# Altium schematic sheet HB_Drive.SchDoc
size 420 x 297 mm; SheetNumber: 2; SheetTotal: 5
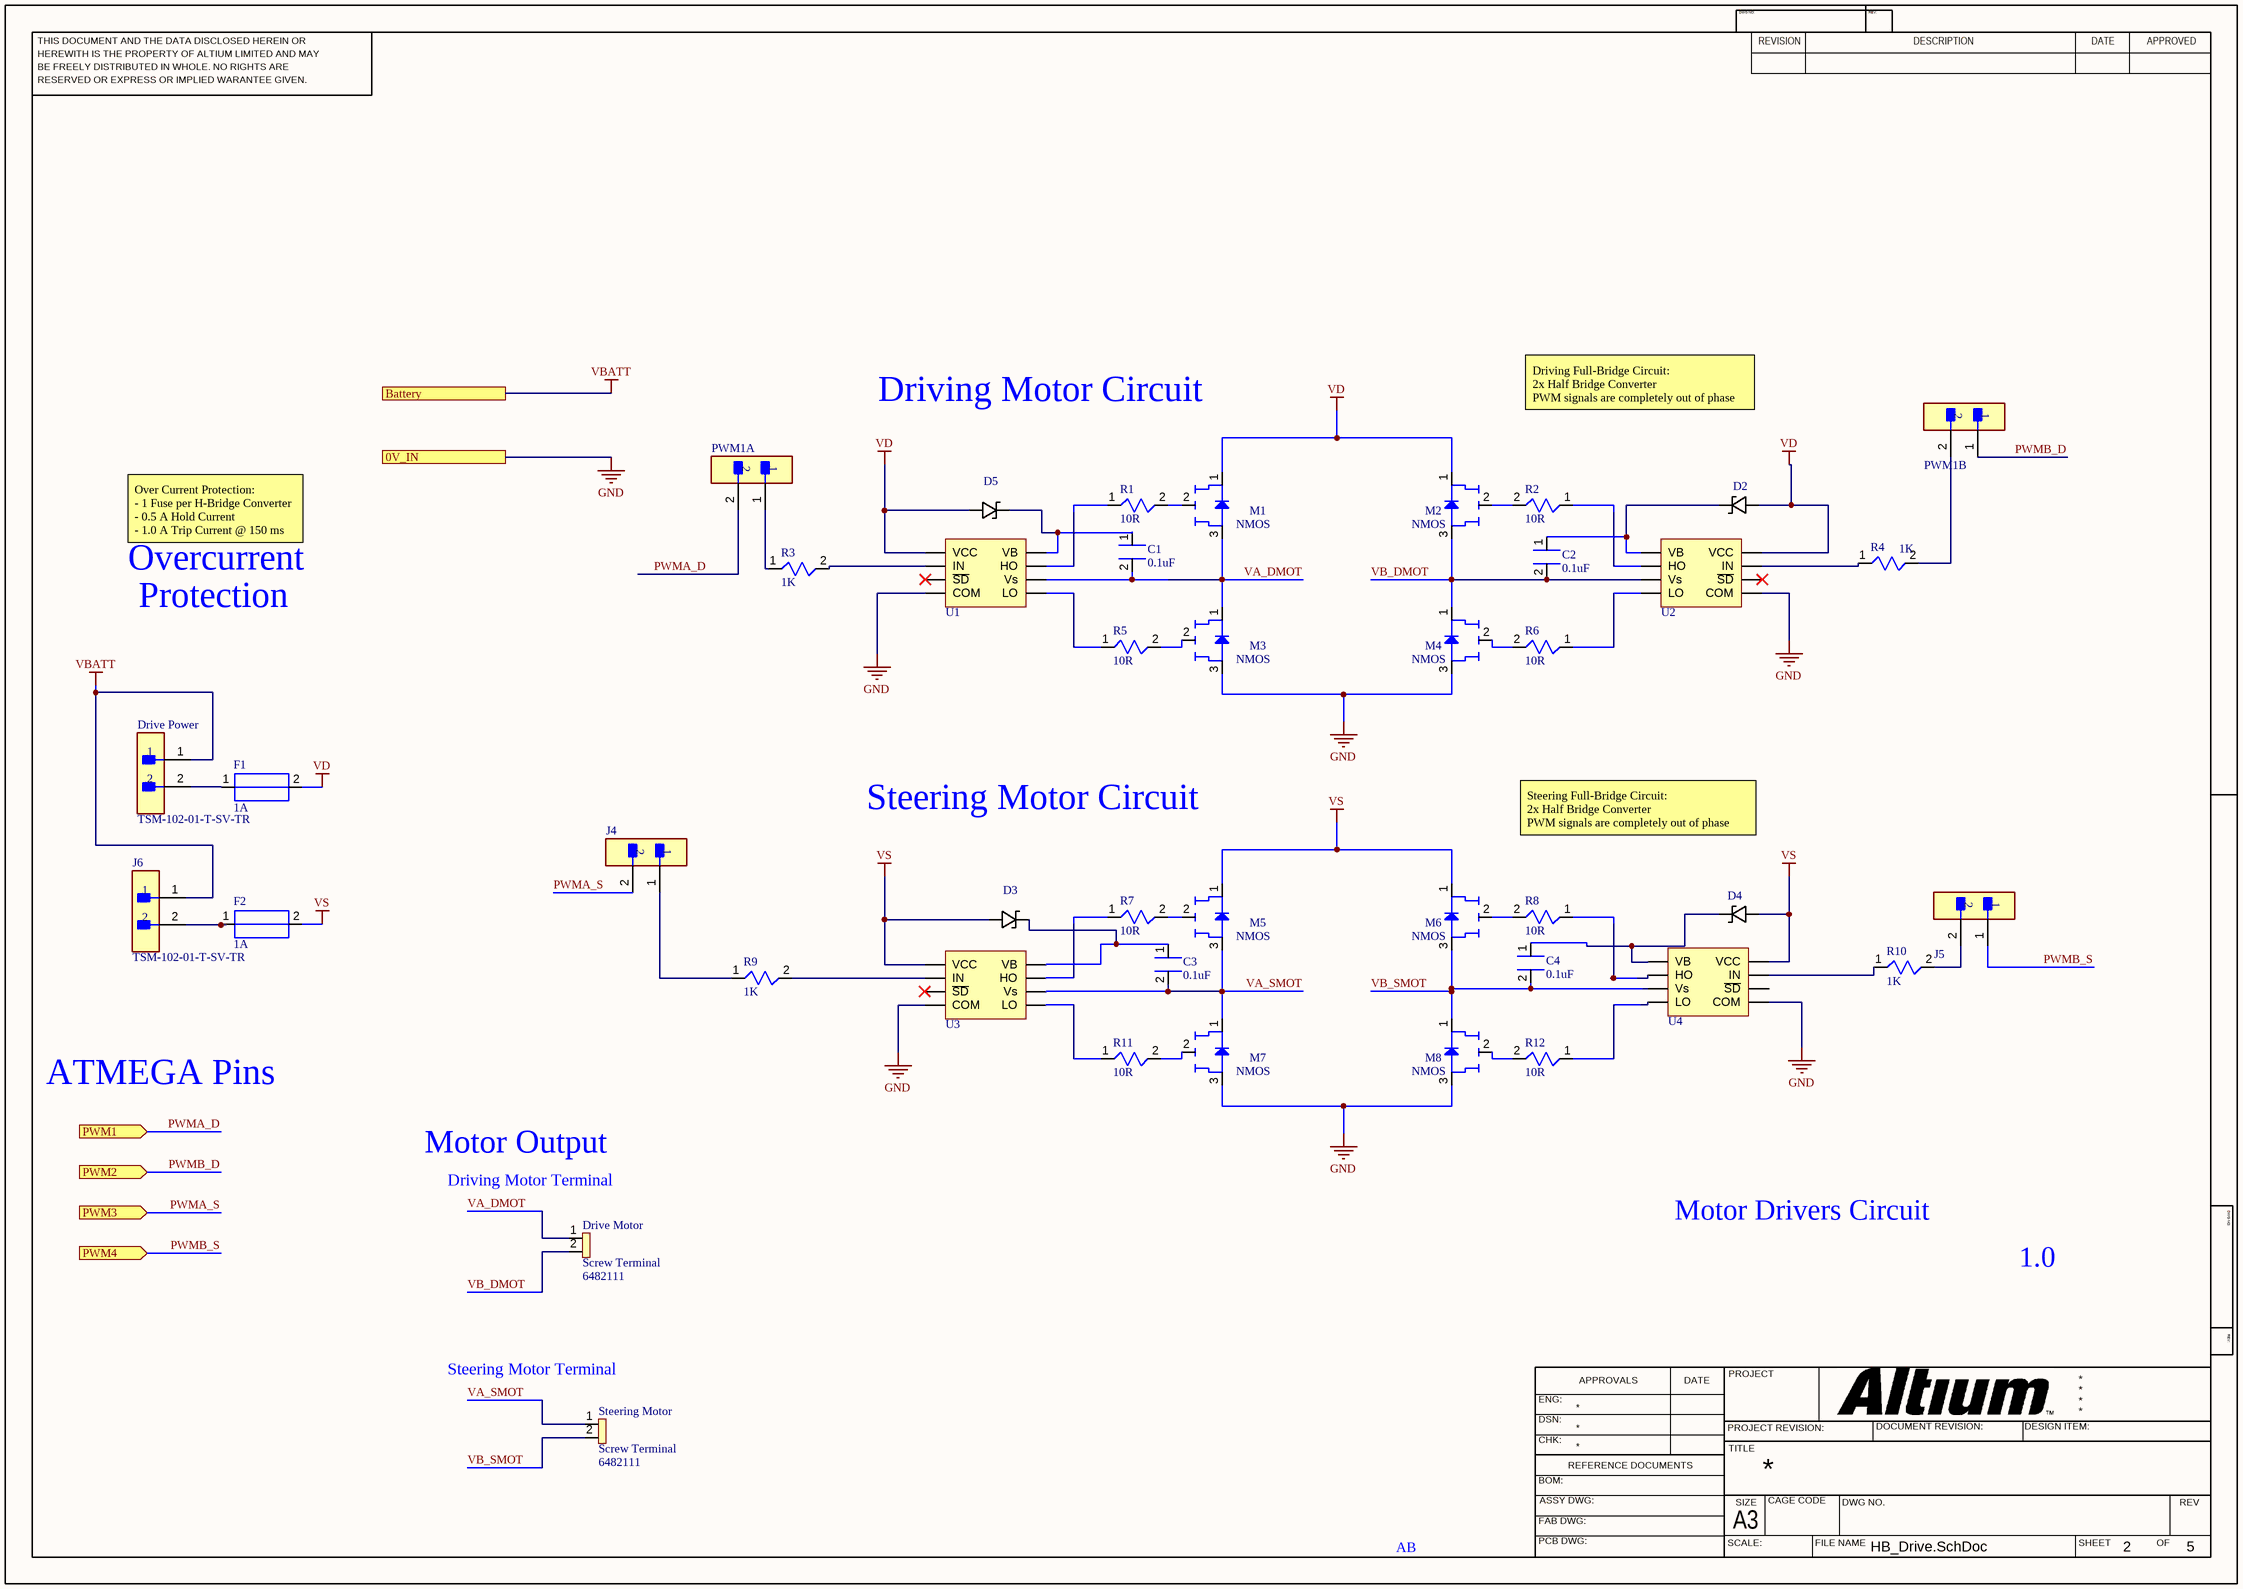
[diagram p0: HB_Drive.SchDoc]

## Parts
C1  0.1uF  [0805B104K500BD]
C2  0.1uF  [0805B104K500BD]
C3  0.1uF  [0805B104K500BD]
C4  0.1uF  [0805B104K500BD]
D2  BAS3005B02VH6327XTSA1  [BAS3005B02VH6327XTSA1]  (value not drawn)
D3  BAS3005B02VH6327XTSA1  [BAS3005B02VH6327XTSA1]  (value not drawn)
D4  BAS3005B02VH6327XTSA1  [BAS3005B02VH6327XTSA1]  (value not drawn)
D5  BAS3005B02VH6327XTSA1  [BAS3005B02VH6327XTSA1]  (value not drawn)
Drive_Motor  Screw Terminal  Supplier Part Number 1: 6482111  [ERM BLOCK 2POS 45DEG 2.5MM PCB]
Drive_Power  TSM-102-01-T-SV-TR  [FP-TSM-102-01-T-SV-TR-MFG]
F1  1A  [0ZCG0050AF2C]
F2  1A  [0ZCG0050AF2C]
J4  TSM-102-01-T-SV-TR  [FP-TSM-102-01-T-SV-TR-MFG]  (value not drawn)
J5  TSM-102-01-T-SV-TR  [FP-TSM-102-01-T-SV-TR-MFG]  (value not drawn)
J6  TSM-102-01-T-SV-TR  [FP-TSM-102-01-T-SV-TR-MFG]
M1  NMOS  [AOD424]
M2  NMOS  [AOD424]
M3  NMOS  [AOD424]
M4  NMOS  [AOD424]
M5  NMOS  [AOD424]
M6  NMOS  [AOD424]
M7  NMOS  [AOD424]
M8  NMOS  [AOD424]
PWM1A  TSM-102-01-T-SV-TR  [FP-TSM-102-01-T-SV-TR-MFG]  (value not drawn)
PWM1B  TSM-102-01-T-SV-TR  [FP-TSM-102-01-T-SV-TR-MFG]  (value not drawn)
R1  10R  [RNCP0805FTD10R0]
R2  10R  [RNCP0805FTD10R0]
R3  1K  [RNCP0805FTD10R0]
R4  1K  [RNCP0805FTD10R0]
R5  10R  [RNCP0805FTD10R0]
R6  10R  [RNCP0805FTD10R0]
R7  10R  [RNCP0805FTD10R0]
R8  10R  [RNCP0805FTD10R0]
R9  1K  [RNCP0805FTD10R0]
R10  1K  [RNCP0805FTD10R0]
R11  10R  [RNCP0805FTD10R0]
R12  10R  [RNCP0805FTD10R0]
Steering_Motor  Screw Terminal  Supplier Part Number 1: 6482111  [ERM BLOCK 2POS 45DEG 2.5MM PCB]
U1  IR2302  [IR2302S]  (value not drawn)
U2  IR2302  [IR2302S]  (value not drawn)
U3  IR2302  [IR2302S]  (value not drawn)
U4  IR2302  [IR2302S]  (value not drawn)

## Ports
0V_IN, Battery, PWM1 (in), PWM2 (in), PWM3 (in), PWM4 (in)

## Nets
GND: M3.3(S) M4.3(S) M7.3(S) M8.3(S) U1.4(COM) U2.4(COM) U3.4(COM) U4.4(COM) ; port 0V_IN
VBATT: Drive_Power.1 J6.1 ; port Battery
VD: D2.1 D5.1 F1.2(-) M1.1(D) M2.1(D) U1.1(VCC) U2.1(VCC)
VS: D3.1 D4.1 F2.2(-) M5.1(D) M6.1(D) U3.1(VCC) U4.1(VCC)
PWMA_D: PWM1A.2 ; port PWM1
PWMA_S: J4.2 ; port PWM3
PWMB_D: PWM1B.1 ; port PWM2
PWMB_S: J5.1 ; port PWM4
VA_DMOT: C1.2 Drive_Motor.1 M1.3(S) M3.1(D) U1.6(Vs)
VA_SMOT: C3.2 M5.3(S) M7.1(D) Steering_Motor.1 U3.6(Vs)
VB_DMOT: C2.2 Drive_Motor.2 M2.3(S) M4.1(D) U2.6(Vs)
VB_SMOT: C4.2 M6.3(S) M8.1(D) Steering_Motor.2 U4.6(Vs)
NetC1_1: C1.1(+) D5.2 U1.8(VB)
NetC2_1: C2.1(+) D2.2 U2.8(VB)
NetC3_1: C3.1(+) D3.2 U3.8(VB)
NetC4_1: C4.1(+) D4.2 U4.8(VB)
NetDrive_Power_2: Drive_Power.2 F1.1(+)
NetF2_1: F2.1(+) J6.2
NetJ4_1: J4.1 R9.1(+)
NetJ5_2: J5.2 R10.2(-)
NetM1_2: M1.2(G) R1.2(-)
NetM2_2: M2.2(G) R2.2(-)
NetM3_2: M3.2(G) R5.2(-)
NetM4_2: M4.2(G) R6.2(-)
NetM5_2: M5.2(G) R7.2(-)
NetM6_2: M6.2(G) R8.2(-)
NetM7_2: M7.2(G) R11.2(-)
NetM8_2: M8.2(G) R12.2(-)
NetPWM1A_1: PWM1A.1 R3.1(+)
NetPWM1B_2: PWM1B.2 R4.2(-)
NetR1_1: R1.1(+) U1.7(HO)
NetR2_1: R2.1(+) U2.7(HO)
NetR3_2: R3.2(-) U1.2(IN)
NetR4_1: R4.1(+) U2.2(IN)
NetR5_1: R5.1(+) U1.5(LO)
NetR6_1: R6.1(+) U2.5(LO)
NetR7_1: R7.1(+) U3.7(HO)
NetR8_1: R8.1(+) U4.7(HO)
NetR9_2: R9.2(-) U3.2(IN)
NetR10_1: R10.1(+) U4.2(IN)
NetR11_1: R11.1(+) U3.5(LO)
NetR12_1: R12.1(+) U4.5(LO)

Not connected (* = marked no-connect by the designer): U1 3(~{SD})*; U2 3(~{SD})*; U3 3(~{SD})*; U4 3(~{SD})

## Notes on the sheet
- Driving Motor Circuit
- Driving Full-Bridge Circuit:
  2x Half Bridge Converter
  PWM signals are completely out of phase
- Overcurrent
- Over Current Protection:
  - 1 Fuse per H-Bridge Converter
  - 0.5 A Hold Current
  - 1.0 A Trip Current @ 150 ms
- Protection
- Steering Motor Circuit
- Steering Full-Bridge Circuit:
  2x Half Bridge Converter
  PWM signals are completely out of phase
- ATMEGA Pins
- Motor Output
- (near Drive_Motor) Driving Motor Terminal
- Motor Drivers Circuit
- 1.0
- (near Steering_Motor) Steering Motor Terminal
- AB
- THIS DOCUMENT AND THE DATA DISCLOSED HEREIN OR
- HEREWITH IS THE PROPERTY OF ALTIUM LIMITED AND MAY
- DWG NO:
- REVISION
- REV:
- DESCRIPTION
- DATE
- APPROVED
- BE FREELY DISTRIBUTED IN WHOLE. NO RIGHTS ARE
- RESERVED OR EXPRESS OR IMPLIED WARANTEE GIVEN.
- ENG:
- APPROVALS
- PROJECT
- DSN:
- CHK:
- REFERENCE DOCUMENTS
- PROJECT REVISION:
- TITLE
- DOCUMENT REVISION:
- DESIGN ITEM:
- BOM:
- FAB DWG:
- PCB DWG:
- ASSY DWG:
- SCALE:
- A3
- SIZE
- CAGE CODE
- FILE NAME
- DWG NO.
- SHEET
- OF
- REV

## Library data of the parts
C1-C4 = 0805B104K500BD: 0.1 uF 50V Cap
D2-D5 = BAS3005B02VH6327XTSA1: 30V, Vf 620 mV @ 500 mA, 25 µA @ 30 V, Fast Recovery =< 500ns, > 200mA
Drive_Motor Steering_Motor = ERM BLOCK 2POS 45DEG 2.5MM PCB: Supplier 1: RSComponents
Drive_Power J4-J6 PWM1A PWM1B = CMP-02766-000113-1: CONN HEADER SMD 2POS 2.54MM; Gender: Male; Max Voltage Rating (AC): 475V; Number of Contacts: 2; Max Current Rating: 7A; Contact Material: Bronze; Min Operating Temperature: -55°C; REACH SVHC: No SVHC; Housing Material: Polymer; Lead Free: Lead Free; Orientation: Straight; Radiation Hardening: No; Number of Rows: 1; Length: 5.08mm; Housing Color: Black; Max Operating Temperature: 105°C; Contact Plating: Tin; Depth: 2.54mm; Packaging: Tape and Reel; Pitch: 2.54mm; Termination: Solder
F1 F2 = 0ZCG0050AF2C: PTC Resettable Fuse 0.5A(hold) 1A(trip) 30VDC 100A 0.8W 0.15s 0.15Ohm SMD Solder Pad 1812 T/R; Manufacturer: Bel; Hold Current: 500mA; Supplier 1: Newark; Manufacturer Part Number: 0ZCG0050AF2C; RoHS: Yes; Category: PTC Resettable Fuses; Stock 1: 19101; Pricing 1: 1=0.14000, 10=0.12900, 25=0.12200, 50=0.11500, 100=0.10700, 250=0.09600 (USD); Mount: Surface Mount; Case/Package: 1812; Case Code (Metric): 4532; Case Code (Imperial): 1812; Contact Plating: Tin,Matte; Min Operating Temperature: -40°C; Max Operating Temperature: 85°C; Package Quantity: 1; Packaging: Tape and Reel; Max Current Rating: 100A; Trip Current: 1A; Time to Trip: 0.15s; Lead Free: Lead Free; RoHS Compliant: Yes; ComponentLink1URL: https://datasheet.ciiva.com/18550/0zcg-18550748.pdf?src-supplier=Digi-Key; ComponentLink1Description: https://datasheet.ciiva.com/18550/0zcg-18550748.pdf?src-supplier=Digi-Key; ComponentLink2URL: https://datasheet.ciiva.com/18550/0zcg-18550749.pdf?src-supplier=Digi-Key; ComponentLink2Description: https://datasheet.ciiva.com/18550/0zcg-18550749.pdf?src-supplier=Digi-Key; ComponentLink3URL: https://datasheet.ciiva.com/18550/0zcg-18550750.pdf?src-supplier=Digi-Key; ComponentLink3Description: https://datasheet.ciiva.com/18550/0zcg-18550750.pdf?src-supplier=Digi-Key; Supplier Part Number 1: 48AC8390
M1-M8 = AOD424: MOSFET N-CH 20V 18A TO252; Manufacturer: Alpha & Omega Semiconductor; Rds On Max: 4.4mR; Input Capacitance: 4.63nF; Continuous Drain Current (ID): 45A; Max Power Dissipation: 2.5W; Number of Outputs: 2; Rise Time: 220ns; Output Current: 200mA; Min Supply Voltage: 5V; Nominal Supply Current: 1.6mA; Output Voltage: 620V; Propagation Delay: 950ns; Max Output Current: 350mA; Fall Time: 80ns; Turn-Off Delay Time: 70ns; Power Dissipation: 625mW; Min Output Voltage: 10V; Supplier 1: Digi-Key; Manufacturer Part Number: AOD424; RoHS: Yes; Category: Transistors; Stock 1: 1803; Pricing 1: 1=0.98000, 10=0.86400, 100=0.66240, 500=0.52360, 1000=0.41888 (USD); Mount: Surface Mount; Case/Package: TO-252-3; Min Operating Temperature: -55°C; Max Operating Temperature: 175°C; Packaging: Tape and Reel; Drain to Source Voltage (Vdss): 20V; Series: -; RoHS Compliant: Yes; ComponentLink1URL: https://datasheet.ciiva.com/6384/aod424-6384722.pdf?src-supplier=Digi-Key; ComponentLink1Description: https://datasheet.ciiva.com/6384/aod424-6384722.pdf?src-supplier=Digi-Key; ComponentLink2URL: https://datasheet.ciiva.com/6384/aod424-6384725.pdf?src-supplier=Digi-Key; ComponentLink2Description: https://datasheet.ciiva.com/6384/aod424-6384725.pdf?src-supplier=Digi-Key; Supplier 2: Newark; Number of Pins: 8; Package Quantity: 950; Max Supply Voltage: 20V; Number of Drivers: 2; Turn-On Delay Time: 70ns; Max Supply Current: 1.6mA; Max Output Voltage: 20V; Termination: SMD/SMT; Length: 5mm; Width: 4mm; Height: 1.5mm; Radiation Hardening: No; Lead Free: Lead Free; REACH SVHC: No SVHC; ComponentLink3URL: https://datasheet.ciiva.com/1952/ir2302-1952914.pdf?src-supplier=Digi-Key; ComponentLink3Description: https://datasheet.ciiva.com/1952/ir2302-1952914.pdf?src-supplier=Digi-Key; ComponentLink4URL: https://datasheet.ciiva.com/15110/getdatasheetpartid-188955-15110020.pdf?src-supplier=Verical; ComponentLink4Description: https://datasheet.ciiva.com/15110/getdatasheetpartid-188955-15110020.pdf?src-supplier=Verical; ComponentLink5URL: https://datasheet.ciiva.com/1499/60025-1499718.pdf?src-supplier=Element14; ComponentLink5Description: https://datasheet.ciiva.com/1499/60025-1499718.pdf?src-supplier=Element14; Supplier Part Number 1: 785-1565-1-ND
R1 R2 R5-R8 R11 R12 = RNCP0805FTD10R0: RES 10 OHM 1% 1/4W 0805; Manufacturer: Stackpole Electronics; Max Power Dissipation: 250mW; Temperature Coefficient: 100ppm/°C; Supplier 1: Avnet; Manufacturer Part Number: RNCP0805FTD10R0; RoHS: Yes; Category: Chip SMD Resistors; Stock 1: 65000; Pricing 1: 5000=0.00682, 10000=0.00672, 20000=0.00653, 30000=0.00638, 40000=0.00614, 50000=0.00600, 500000=0.00586 (USD); Mount: Surface Mount; Case/Package: 0805; Case Code (Metric): 2012; Case Code (Imperial): 0805; Min Operating Temperature: -55°C; Max Operating Temperature: 155°C; Resistance: 10R; Tolerance: 1%; Packaging: Tape and Reel; Resistor Type: Thin Film; Number of Terminations: 2; Features: Moisture Resistant,Anti-Sulfur; Series: RNCP; Length: 0.079inch; Width: 0.049inch; Height: 0.024inch; RoHS Compliant: Yes; ComponentLink1URL: https://www.seielect.com/catalog/sei-rncp.pdf?src-supplier=Digi-Key; ComponentLink1Description: https://www.seielect.com/catalog/sei-rncp.pdf?src-supplier=Digi-Key; Supplier Part Number 1: RNCP0805FTD10R0
R3 R4 R9 R10 = RNCP0805FTD1K00: Res Thin Film 0805 1K Ohm 1% 0.25W(1/4W) ±100ppm/C Sulfur Resistant Pad SMD T/R; Manufacturer: Stackpole Electronics; Resistance: 1kR; Power Rating: 250mW; Temperature Coefficient: 100ppm/°C; Supplier 1: Digi-Key; Manufacturer Part Number: RNCP0805FTD1K00; RoHS: Yes; Category: Chip SMD Resistors; Stock 1: 41120; Pricing 1: 1=0.10000, 10=0.07300, 100=0.02970, 1000=0.01336, 2500=0.01159 (USD); Mount: Surface Mount; Case/Package: 0805; Case Code (Metric): 2012; Case Code (Imperial): 0805; Size Code: 0805; Min Operating Temperature: -55°C; Max Operating Temperature: 155°C; Tolerance: 1%; Packaging: Tape and Reel; Resistor Type: Thin Film; Number of Terminations: 2; Max Power Dissipation: 250mW; Features: Moisture Resistant,Anti-Sulfur; Series: RNCP; Length: 0.079inch; Width: 0.049inch; Height: 0.024inch; Lead Free: Lead Free; RoHS Compliant: Yes; ComponentLink1URL: http://www.seielect.com/Catalog/SEI-rncp.pdf?src-supplier=Future+Electronics; ComponentLink1Description: http://www.seielect.com/Catalog/SEI-rncp.pdf?src-supplier=Future+Electronics; ComponentLink2URL: https://www.seielect.com/Catalog/SEI-rncp.pdf?src-supplier=Digi-Key; ComponentLink2Description: https://www.seielect.com/Catalog/SEI-rncp.pdf?src-supplier=Digi-Key; ComponentLink3URL: https://www.seielect.com/catalog/SEI-Packaging.pdf?src-supplier=Digi-Key; ComponentLink3Description: https://www.seielect.com/catalog/SEI-Packaging.pdf?src-supplier=Digi-Key; Supplier Part Number 1: RNCP0805FTD1K00CT-ND
U1-U4 = IR2302: Manufacture Part Number: IR2302